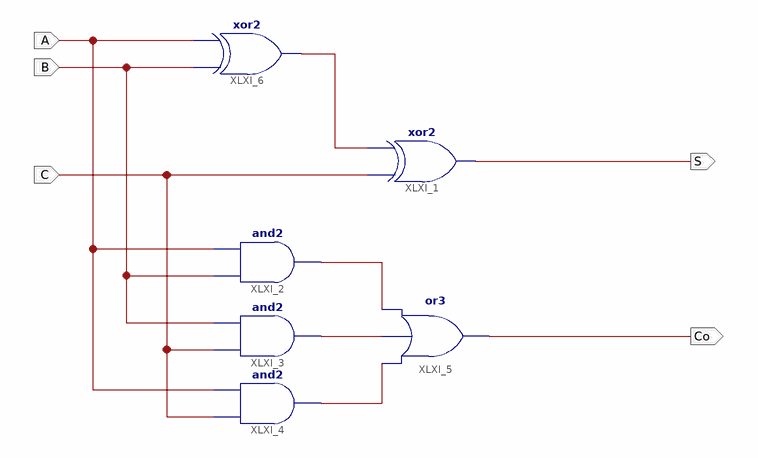
[diagram p0: schematic sheet 1]
// Xilinx ISE schematic Adder1b.sch (kintex7) as structural Verilog: 6 symbols, 5 ports
module Adder1b (
  input  A,
  input  B,
  input  C,
  output S,
  output Co
);

  wire XLXN_4, XLXN_13, XLXN_14, XLXN_15;

  xor XLXI_1 (S, C, XLXN_4);
  and XLXI_2 (XLXN_13, B, A);
  and XLXI_3 (XLXN_14, C, B);
  and XLXI_4 (XLXN_15, C, A);
  or XLXI_5 (Co, XLXN_15, XLXN_14, XLXN_13);
  xor XLXI_6 (XLXN_4, B, A);
endmodule
